# Altium schematic sheet main.SchDoc
size A3
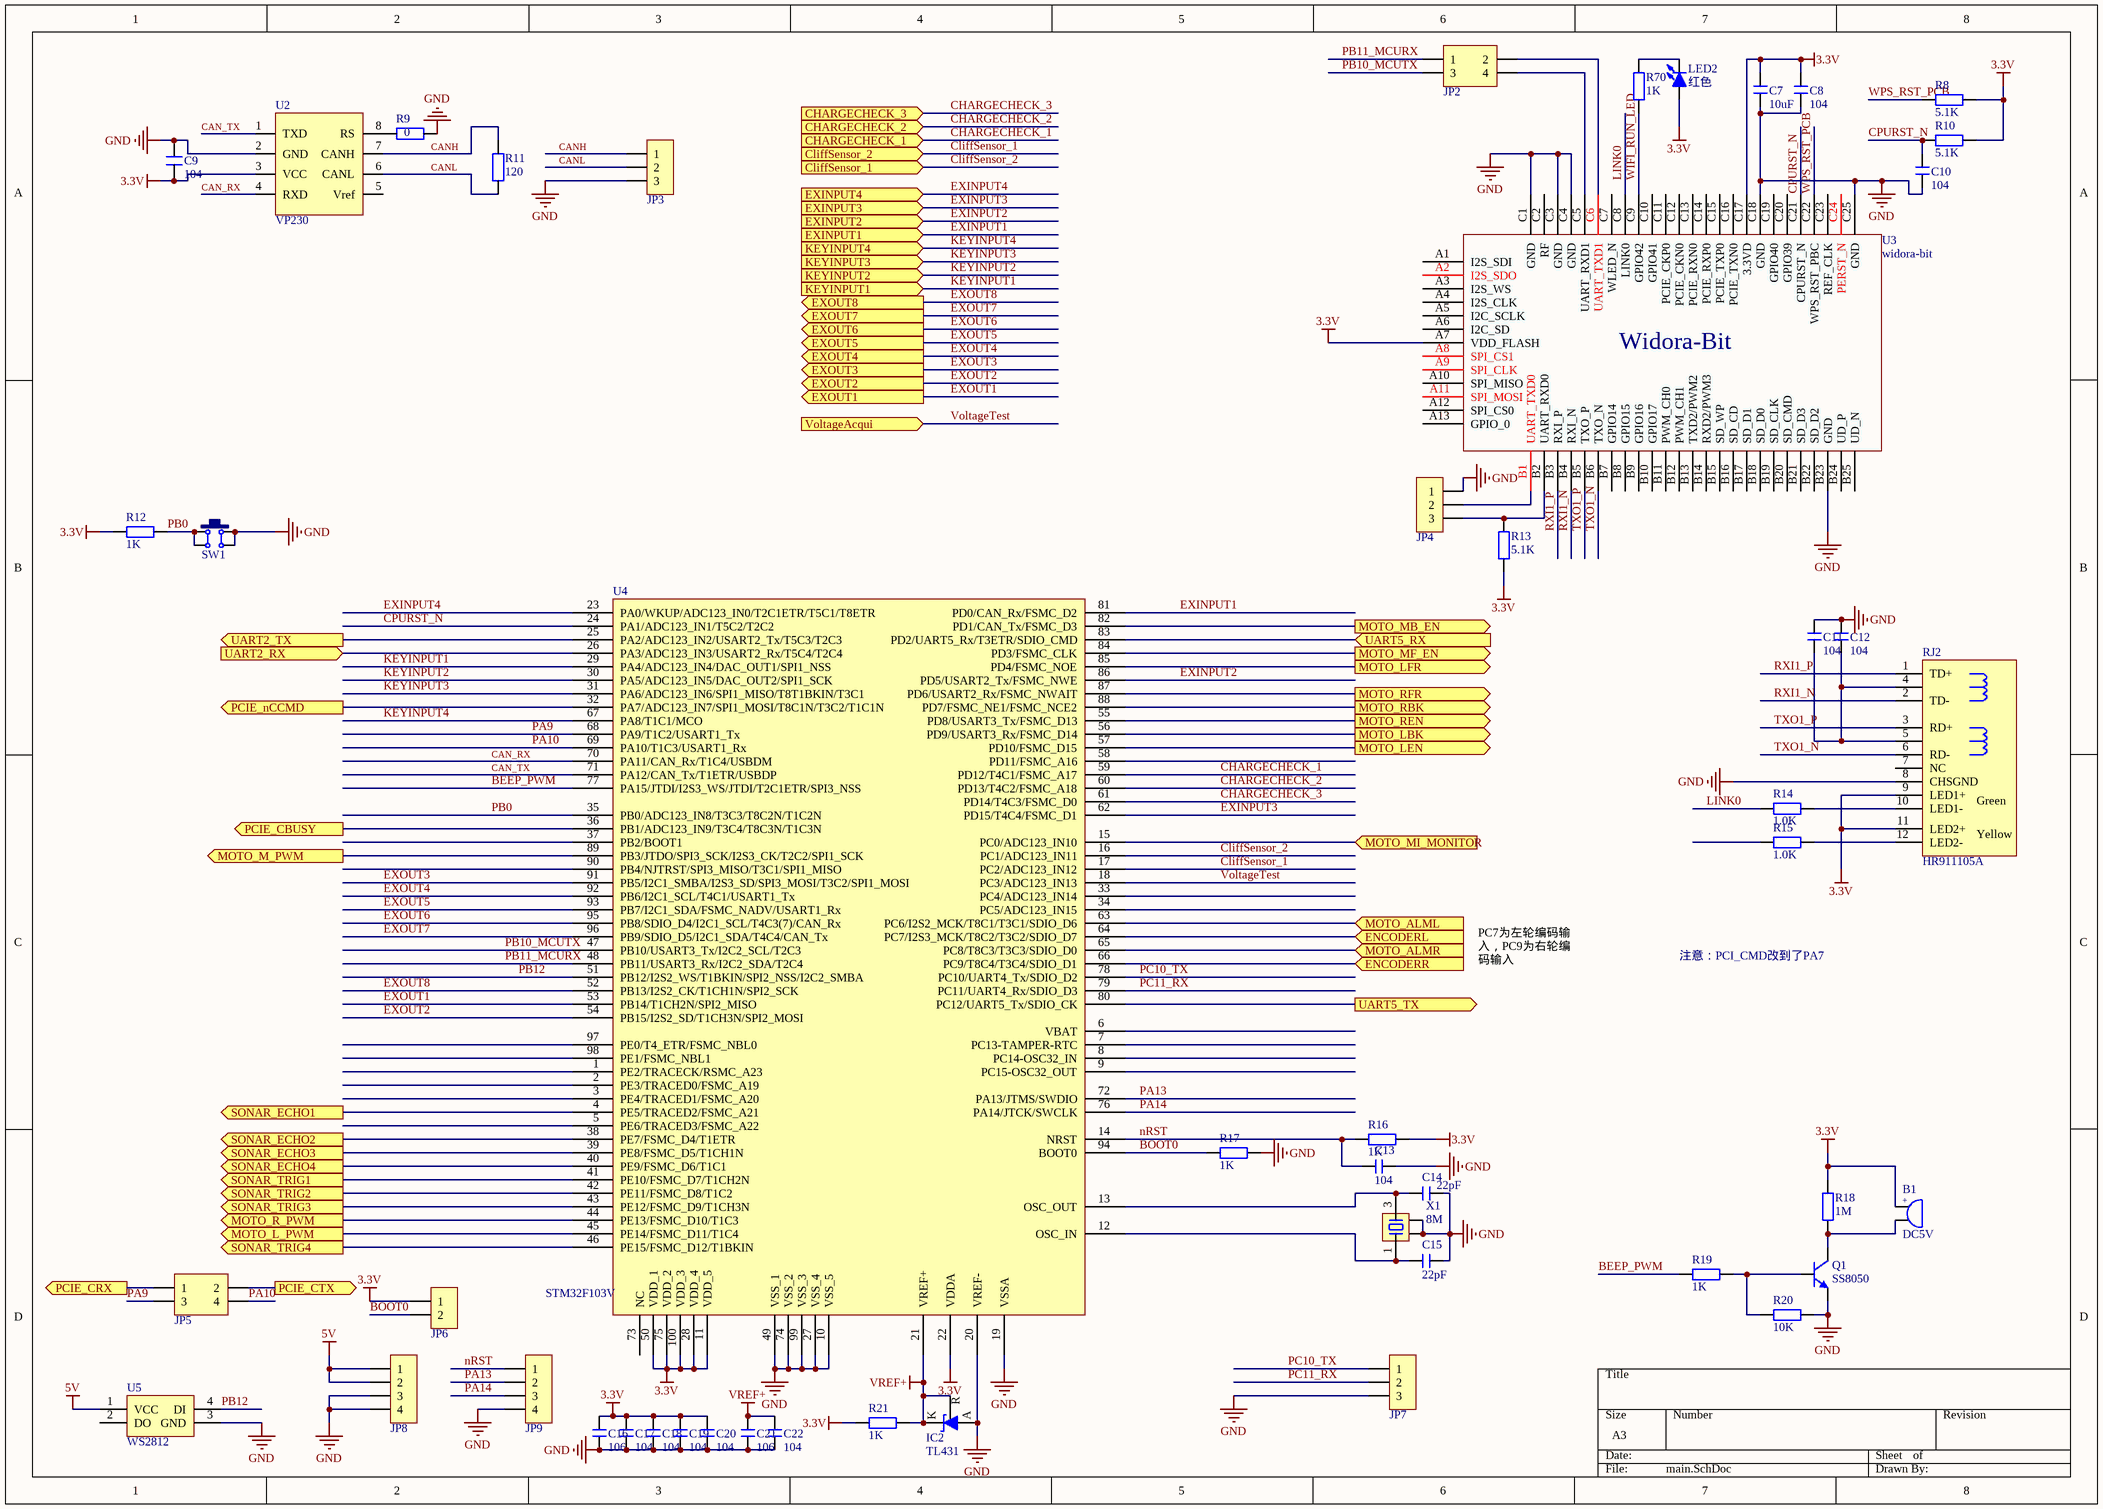
[diagram p0: main.SchDoc]

## Parts
B1  DC5V  [BEEP 6.5x12x8.5]
C7  10uF  [C 0805_L]
C8  104  [C 0603_L]
C9  104  [C 0603_L]
C10  104  [C 0603_L]
C11  104  [C 0603_L]
C12  104  [C 0603_L]
C13  104  [C 0603_L]
C14  22pF  [C 0603_L]
C15  22pF  [C 0603_L]
C16  106  [C 0603_L]
C17  104  [C 0603_L]
C18  104  [C 0603_L]
C19  104  [C 0603_L]
C20  104  [C 0603_L]
C21  106  [C 0603_L]
C22  104  [C 0603_L]
IC2  TL431  [SOT23-3N]
JP2  Header2X2  [HDR2.54-LI-2x2P]  (value not drawn)
JP3  HDR-1X3  [XH2.54-LI-3P]  (value not drawn)
JP4  HDR-1X3  [XH2.54-LI-3P]  (value not drawn)
JP5  Header2X2  [HDR2.54-LI-2x2P]  (value not drawn)
JP6  HDR-1X2  [HDR2.54-LI-2P]  (value not drawn)
JP7  HDR-1X3  [XH2.54-LI-3P]  (value not drawn)
JP8  HDR-1X4  [HDR2.54-LI-2x2P]  (value not drawn)
JP9  HDR-1X4  [XH2.54-LI-4P]  (value not drawn)
LED2  红色  [LED 0603G]
Q1  SS8050  [SOT23-3N]
R8  5.1K  [R 0603_L]
R9  0  [R 0603_L]
R10  5.1K  [R 0603_L]
R11  120  [R 0603_L]
R12  1K  [R 0603_L]
R13  5.1K  [R 0603_L]
R14  1.0K  [R 0603_L]
R15  1.0K  [R 0603_L]
R16  1K  [R 0603_L]
R17  1K  [R 0603_L]
R18  1M  [R 0603_L]
R19  1K  [R 0603_L]
R20  10K  [R 0603_L]
R21  1K  [R 0603_L]
R70  1K  [R 0603_L]
RJ2  HR911105A  [RJ-45A12]
SW1  6x6x5  [TSW DIP-6*6*6]  (value not drawn)
U2  VP230  [SOP8_N]
U3  widora-bit  [Widora-BIT2]
U4  STM32F103V  [LQFP100 14X14_N]
U5  WS2812  [WS2812]
X1  8M  [OSC 3225-4P]

## Ports
CHARGECHECK_1 (in), CHARGECHECK_2 (in), CHARGECHECK_3 (in), CliffSensor_1 (in), CliffSensor_2 (in), ENCODERL (in), ENCODERR (in), EXINPUT1 (in), EXINPUT2 (in), EXINPUT3 (in), EXINPUT4 (in), EXOUT1 (out), EXOUT2 (out), EXOUT3 (out), EXOUT4 (out), EXOUT5 (out), EXOUT6 (out), EXOUT7 (out), EXOUT8 (out), KEYINPUT1 (in), KEYINPUT2 (in), KEYINPUT3 (in), KEYINPUT4 (in), MOTO_ALML (in), MOTO_ALMR (in), MOTO_L_PWM (out), MOTO_LBK (out), MOTO_LEN (out), MOTO_LFR (out), MOTO_M_PWM (out), MOTO_MB_EN (out), MOTO_MF_EN (out), MOTO_MI_MONITOR (in), MOTO_R_PWM (out), MOTO_RBK (out), MOTO_REN (out), MOTO_RFR (out), PCIE_CBUSY (out), PCIE_CRX (out), PCIE_CTX (out), PCIE_nCCMD (out), SONAR_ECHO1 (out), SONAR_ECHO2 (out), SONAR_ECHO3 (out), SONAR_ECHO4 (out), SONAR_TRIG1 (out), SONAR_TRIG2 (out), SONAR_TRIG3 (out), SONAR_TRIG4 (out), UART2_RX (in), UART2_TX (out), UART5_RX (in), UART5_TX (out), VoltageAcqui (in)

## Nets
3.3V: B1.1 C7.2 C8.2 C9.1 C16.2 C17.2 C18.2 C19.2 C20.2 JP6.1 LED2.1(A) R8.1 R10.1 R12.2 R13.2 R16.1 R18.2 R21.2 RJ2.9(LED1+) RJ2.11(LED2+) U2.3(VCC) U3.A7(VDD_FLASH) U3.C17(3.3VD) U4.11(VDD_5) U4.22(VDDA) U4.28(VDD_4) U4.50(VDD_1) U4.75(VDD_2) U4.100(VDD_3)
5V: JP8.1 JP8.2 U5.1(VCC)
GND: C7.1 C8.1 C9.2 C10.1 C11.2 C12.2 C13.1 C14.1 C15.1 C16.1 C17.1 C18.1 C19.1 C20.1 C21.1 C22.1 IC2.3(A) JP3.3 JP4.1 JP7.3 JP8.3 JP8.4 JP9.4 Q1.2(E) R9.2 R17.1 R20.1 RJ2.8(CHSGND) SW1.2 SW1.3 U2.2(GND) U3.B23(GND) U3.C1(GND) U3.C3(GND) U3.C4(GND) U3.C18(GND) U3.C25(GND) U4.10(VSS_5) U4.19(VSSA) U4.20(VREF-) U4.27(VSS_4) U4.49(VSS_1) U4.74(VSS_2) U4.99(VSS_3) U5.3(GND) X1.2 X1.4
VREF+: C21.2 C22.2 IC2.1(R) IC2.2(K) R21.1 U4.21(VREF+)
BEEP_PWM: R19.2 U4.77(PA15/JTDI/I2S3_WS/JTDI/T2C1ETR/SPI3_NSS)
BOOT0: JP6.2 R17.2 U4.94(BOOT0)
CAN_RX: U2.4(RXD) U4.70(PA11/CAN_Rx/T1C4/USBDM)
CAN_TX: U2.1(TXD) U4.71(PA12/CAN_Tx/T1ETR/USBDP)
CANH: JP3.1 R11.2 U2.7(CANH)
CANL: JP3.2 R11.1 U2.6(CANL)
CHARGECHECK_1: U4.59(PD12/T4C1/FSMC_A17) ; port CHARGECHECK_1
CHARGECHECK_2: U4.60(PD13/T4C2/FSMC_A18) ; port CHARGECHECK_2
CHARGECHECK_3: U4.61(PD14/T4C3/FSMC_D0) ; port CHARGECHECK_3
CliffSensor_1: U4.17(PC2/ADC123_IN12) ; port CliffSensor_2
CliffSensor_2: U4.16(PC1/ADC123_IN11) ; port CliffSensor_1
CPURST_N: C10.2 R10.2 U3.C21(CPURST_N) U4.24(PA1/ADC123_IN1/T5C2/T2C2)
ENCODERL: U4.64(PC7/I2S3_MCK/T8C2/T3C2/SDIO_D7) ; port ENCODERL
ENCODERR: U4.66(PC9/T8C4/T3C4/SDIO_D1) ; port ENCODERR
EXINPUT1: U4.81(PD0/CAN_Rx/FSMC_D2) ; port EXINPUT1
EXINPUT2: U4.86(PD5/USART2_Tx/FSMC_NWE) ; port EXINPUT2
EXINPUT3: U4.62(PD15/T4C4/FSMC_D1) ; port EXINPUT3
EXINPUT4: U4.23(PA0/WKUP/ADC123_IN0/T2C1ETR/T5C1/T8ETR) ; port EXINPUT4
EXOUT1: U4.53(PB14/T1CH2N/SPI2_MISO) ; port EXOUT1
EXOUT2: U4.54(PB15/I2S2_SD/T1CH3N/SPI2_MOSI) ; port EXOUT2
EXOUT3: U4.91(PB5/I2C1_SMBA/I2S3_SD/SPI3_MOSI/T3C2/SPI1_MOSI) ; port EXOUT3
EXOUT4: U4.92(PB6/I2C1_SCL/T4C1/USART1_Tx) ; port EXOUT4
EXOUT5: U4.93(PB7/I2C1_SDA/FSMC_NADV/USART1_Rx) ; port EXOUT5
EXOUT6: U4.95(PB8/SDIO_D4/I2C1_SCL/T4C3(7)/CAN_Rx) ; port EXOUT6
EXOUT7: U4.96(PB9/SDIO_D5/I2C1_SDA/T4C4/CAN_Tx) ; port EXOUT7
EXOUT8: U4.52(PB13/I2S2_CK/T1CH1N/SPI2_SCK) ; port EXOUT8
KEYINPUT1: U4.29(PA4/ADC123_IN4/DAC_OUT1/SPI1_NSS) ; port KEYINPUT1
KEYINPUT2: U4.30(PA5/ADC123_IN5/DAC_OUT2/SPI1_SCK) ; port KEYINPUT2
KEYINPUT3: U4.31(PA6/ADC123_IN6/SPI1_MISO/T8T1BKIN/T3C1) ; port KEYINPUT3
KEYINPUT4: U4.67(PA8/T1C1/MCO) ; port KEYINPUT4
LINK0: R14.1 U3.C8(LINK0)
MOTO_ALML: U4.63(PC6/I2S2_MCK/T8C1/T3C1/SDIO_D6) ; port MOTO_ALML
MOTO_ALMR: U4.65(PC8/T8C3/T3C3/SDIO_D0) ; port MOTO_ALMR
MOTO_L_PWM: U4.45(PE14/FSMC_D11/T1C4) ; port MOTO_L_PWM
MOTO_LBK: U4.56(PD9/USART3_Rx/FSMC_D14) ; port MOTO_LBK
MOTO_LEN: U4.57(PD10/FSMC_D15) ; port MOTO_LEN
MOTO_LFR: U4.85(PD4/FSMC_NOE) ; port MOTO_LFR
MOTO_M_PWM: U4.89(PB3/JTDO/SPI3_SCK/I2S3_CK/T2C2/SPI1_SCK) ; port MOTO_M_PWM
MOTO_MB_EN: U4.82(PD1/CAN_Tx/FSMC_D3) ; port MOTO_MB_EN
MOTO_MF_EN: U4.84(PD3/FSMC_CLK) ; port MOTO_MF_EN
MOTO_MI_MONITOR: U4.15(PC0/ADC123_IN10) ; port MOTO_MI_MONITOR
MOTO_R_PWM: U4.44(PE13/FSMC_D10/T1C3) ; port MOTO_R_PWM
MOTO_RBK: U4.88(PD7/FSMC_NE1/FSMC_NCE2) ; port MOTO_RBK
MOTO_REN: U4.55(PD8/USART3_Tx/FSMC_D13) ; port MOTO_REN
MOTO_RFR: U4.87(PD6/USART2_Rx/FSMC_NWAIT) ; port MOTO_RFR
nRST: C13.2 JP9.1 R16.2 U4.14(NRST)
PA9: JP5.3 U4.68(PA9/T1C2/USART1_Tx)
PA10: JP5.4 U4.69(PA10/T1C3/USART1_Rx)
PA13: JP9.2 U4.72(PA13/JTMS/SWDIO)
PA14: JP9.3 U4.76(PA14/JTCK/SWCLK)
PB0: R12.1 SW1.1 SW1.4 U4.35(PB0/ADC123_IN8/T3C3/T8C2N/T1C2N)
PB10_MCUTX: JP2.3 U4.47(PB10/USART3_Tx/I2C2_SCL/T2C3)
PB11_MCURX: JP2.1 U4.48(PB11/USART3_Rx/I2C2_SDA/T2C4)
PB12: U4.51(PB12/I2S2_WS/T1BKIN/SPI2_NSS/I2C2_SMBA) U5.4(DI)
PC10_TX: JP7.1 U4.78(PC10/UART4_Tx/SDIO_D2)
PC11_RX: JP7.2 U4.79(PC11/UART4_Rx/SDIO_D3)
PCIE_CBUSY: U4.36(PB1/ADC123_IN9/T3C4/T8C3N/T1C3N) ; port PCIE_CBUSY
PCIE_CRX: JP5.1 ; port PCIE_CRX
PCIE_CTX: JP5.2 ; port PCIE_CTX
PCIE_nCCMD: U4.32(PA7/ADC123_IN7/SPI1_MOSI/T8C1N/T3C2/T1C1N) ; port PCIE_nCCMD
RXI1_N: RJ2.2(TD-) U3.B4(RXI_N)
RXI1_P: RJ2.1(TD+) U3.B3(RXI_P)
SONAR_ECHO1: U4.4(PE5/TRACED2/FSMC_A21) ; port SONAR_ECHO1
SONAR_ECHO2: U4.38(PE7/FSMC_D4/T1ETR) ; port SONAR_ECHO2
SONAR_ECHO3: U4.39(PE8/FSMC_D5/T1CH1N) ; port SONAR_ECHO3
SONAR_ECHO4: U4.40(PE9/FSMC_D6/T1C1) ; port SONAR_ECHO4
SONAR_TRIG1: U4.41(PE10/FSMC_D7/T1CH2N) ; port SONAR_TRIG1
SONAR_TRIG2: U4.42(PE11/FSMC_D8/T1C2) ; port SONAR_TRIG2
SONAR_TRIG3: U4.43(PE12/FSMC_D9/T1CH3N) ; port SONAR_TRIG3
SONAR_TRIG4: U4.46(PE15/FSMC_D12/T1BKIN) ; port SONAR_TRIG4
TXO1_N: RJ2.6(RD-) U3.B6(TXO_N)
TXO1_P: RJ2.3(RD+) U3.B5(TXO_P)
UART2_RX: U4.26(PA3/ADC123_IN3/USART2_Rx/T5C4/T2C4) ; port UART2_RX
UART2_TX: U4.25(PA2/ADC123_IN2/USART2_Tx/T5C3/T2C3) ; port UART2_TX
UART5_RX: U4.83(PD2/UART5_Rx/T3ETR/SDIO_CMD) ; port UART5_RX
UART5_TX: U4.80(PC12/UART5_Tx/SDIO_CK) ; port UART5_TX
VoltageTest: U4.18(PC3/ADC123_IN13) ; port VoltageAcqui
WIFI_RUN_LED: R70.2 U3.C9(GPIO42)
WPS_RST_PCB: R8.2 U3.C22(WPS_RST_PBC)
NetB1_2: B1.2 Q1.3(C) R18.1
NetC11_1: C11.1 C12.1 RJ2.4 RJ2.5
NetC14_2: C14.2 U4.13(OSC_OUT) X1.3
NetC15_2: C15.2 U4.12(OSC_IN) X1.1
NetJP2_2: JP2.2 U3.C6(UART_TXD1)
NetJP2_4: JP2.4 U3.C5(UART_RXD1)
NetJP4_2: JP4.2 U3.B1(UART_TXD0)
NetJP4_3: JP4.3 R13.1 U3.B2(UART_RXD0)
NetLED2_2: LED2.2(K) R70.1
NetQ1_1: Q1.1(B) R19.1 R20.2
NetR9_1: R9.1 U2.8(RS)
NetR14_2: R14.2 RJ2.10(LED1-)
NetR15_2: R15.2 RJ2.12(LED2-)

Not connected (* = marked no-connect by the designer): R15 1; RJ2 7(NC); U2 5(Vref); U3 A1(I2S_SDI) A2(I2S_SDO) A3(I2S_WS) A4(I2S_CLK) A5(I2C_SCLK) A6(I2C_SD) A8(SPI_CS1) A9(SPI_CLK) A10(SPI_MISO) A11(SPI_MOSI) A12(SPI_CS0) A13(GPIO_0) B7(GPIO14) B8(GPIO15) B9(GPIO16) B10(GPIO17) B11(PWM_CH0) B12(PWM_CH1) B13(TXD2/PWM2) B14(RXD2/PWM3) B15(SD_WP) B16(SD_CD) B17(SD_D1) B18(SD_D0) B19(SD_CLK) B20(SD_CMD) B21(SD_D3) B22(SD_D2) B24(UD_P) B25(UD_N) C2(RF) C7(WLED_N) C10(GPIO41) C11(PCIE_CKP0) C12(PCIE_CKN0) C13(PCIE_RXN0) C14(PCIE_RXP0) C15(PCIE_TXP0) C16(PCIE_TXN0) C19(GPIO40) C20(GPIO39) C23(REF_CLK) C24(PERST_N); U4 1(PE2/TRACECK/RSMC_A23) 2(PE3/TRACED0/FSMC_A19) 3(PE4/TRACED1/FSMC_A20) 5(PE6/TRACED3/FSMC_A22) 6(VBAT) 7(PC13-TAMPER-RTC) 8(PC14-OSC32_IN) 9(PC15-OSC32_OUT) 33(PC4/ADC123_IN14) 34(PC5/ADC123_IN15) 37(PB2/BOOT1) 58(PD11/FSMC_A16) 73(NC) 90(PB4/NJTRST/SPI3_MISO/T3C1/SPI1_MISO) 97(PE0/T4_ETR/FSMC_NBL0) 98(PE1/FSMC_NBL1); U5 2(DO)

## Notes on the sheet
- PC7为左轮编码输入，PC9为右轮编码输入
- 注意：PCI_CMD改到了PA7
- (in symbol BEEP) +
- (in symbol HR911105A) Green; Yellow
- (in symbol widora-bit) Widora-Bit

## Library data of the parts
B1 = BEEP: 蜂鸣器; 版权归属: 源创客; BOM名称: 蜂鸣器; 学习资源: www.ooocke.com
C7 C8 C10-C22 = C: 无极性贴片电容; 版权归属: 源创客; BOM名称: 无极性贴片电容; 学习资源: www.ooocke.com
C9 = CAP_SMT_0603
IC2 = TL431_SMD: 可调基准稳压芯片; 版权归属: 源创客; BOM名称: 可调基准稳压芯片; 学习资源: www.ooocke.com
JP2 JP5 = Header 2X2: 2*2P接插件; 版权归属: 源创客; BOM名称: 2*2P接插件; 学习资源: www.ooocke.com
JP3 JP4 JP7 = Header 3: 3P接插件; 版权归属: 源创客; BOM名称: 3P接插件; 学习资源: www.ooocke.com
JP6 = Header 2: 2P接插件; 版权归属: 源创客; BOM名称: 2P接插件; 学习资源: www.ooocke.com
JP8 JP9 = Header 4: 4P接插件; 版权归属: 源创客; BOM名称: 4P接插件; 学习资源: www.ooocke.com
LED2 = LED-SMD: 贴片LED; 版权归属: 源创客; BOM名称: 贴片LED; 学习资源: www.ooocke.com
Q1 = 8050-SMD: 高频放大-NPN型; 版权归属: 源创客; 属性: 40V 1.5A 1W 100MHZ; BOM名称: 高频放大-NPN型; 学习资源: www.ooocke.com
R8 R10 R12-R21 R70 = R: 贴片电阻; 版权归属: 源创客; BOM名称: 贴片电阻; 学习资源: www.ooocke.com
R9 R11 = RES_SMT_0603
RJ2 = HR911105A: 带灯以太网接口; 版权归属: 源创客; BOM名称: 带灯以太网接口; 学习资源: www.ooocke.com
SW1 = TSW DIP-6x6: 直插6x6轻触开关; 版权归属: 源创客; BOM名称: 直插6x6轻触开关; 学习资源: www.ooocke.com
U4 = STM32F103V: 32位STM单片机100引脚; 版权归属: 源创客; BOM名称: 32位STM单片机100引脚; 学习资源: www.ooocke.com
U5 = WS2812: 集成LED灯
X1 = XTAL-4P: 4脚无源晶振; 版权归属: 源创客; BOM名称: 4脚无源晶振; 学习资源: www.ooocke.com